# Altium schematic sheet CPU.SchDoc
size A3
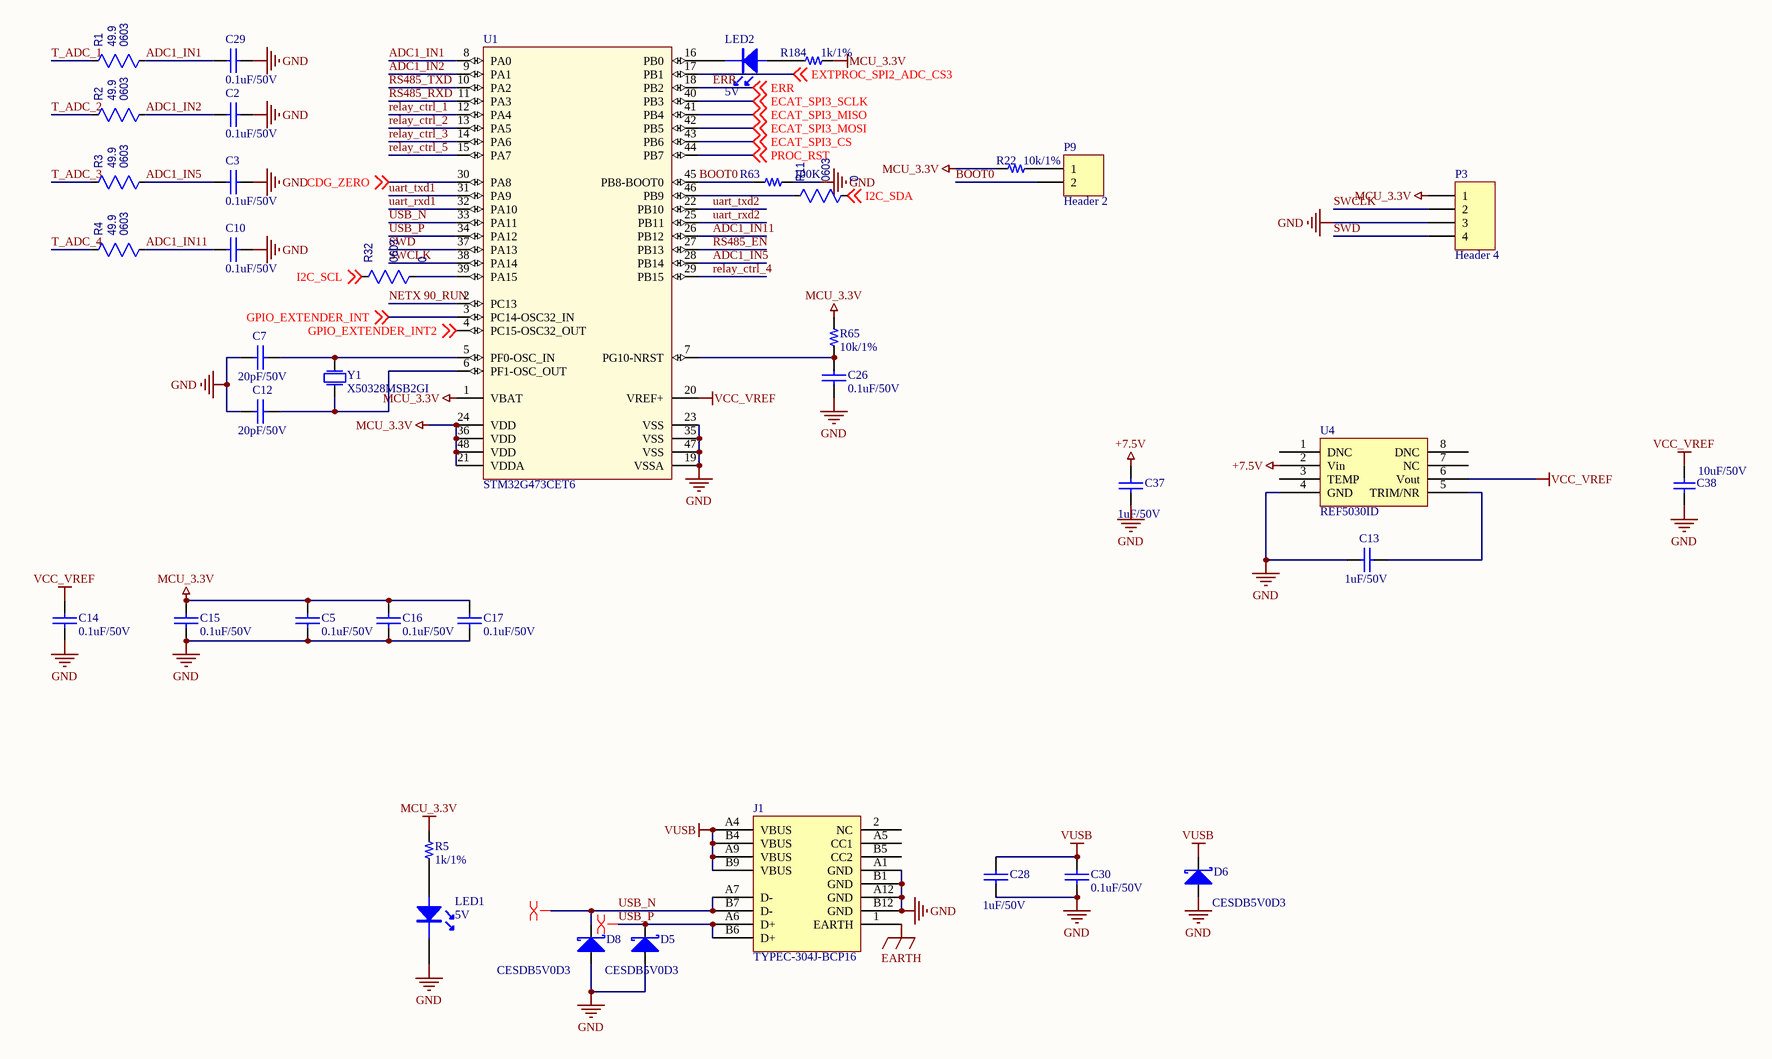
[diagram p0: CPU.SchDoc]

## Parts
C2  0.1uF/50V  [CAPC1608X092N_0603]
C3  0.1uF/50V  [CAPC1608X092N_0603]
C5  0.1uF/50V  [CAPC1608X092N_0603]
C7  value 20pF/50V  [CAPC1608X092N_0603]  (hidden comment: 20pF/25V)
C10  0.1uF/50V  [CAPC1608X092N_0603]
C12  value 20pF/50V  [CAPC1608X092N_0603]  (hidden comment: 20pF/25V)
C13  1uF/50V  [CAPC1608X092N_0603]
C14  0.1uF/50V  [CAPC1608X092N_0603]
C15  0.1uF/50V  [CAPC1608X092N_0603]
C16  0.1uF/50V  [CAPC1608X092N_0603]
C17  0.1uF/50V  [CAPC1608X092N_0603]
C26  0.1uF/50V  [CAPC1608X092N_0603]
C28  1uF/50V  [CAPC1608X092N_0603]
C29  0.1uF/50V  [CAPC1608X092N_0603]
C30  0.1uF/50V  [CAPC1608X092N_0603]
C37  1uF/50V  [CAPC1608X092N_0603]
C38  10uF/50V  [CAPC2012X127N_0805]
D5  CESDB5V0D3  [SOD323]
D6  CESDB5V0D3  [SOD323]
D8  CESDB5V0D3  [SOD323]
J1  TYPEC-304J-BCP16  [TYPEC_16P]
LED1  5V  [0603LED]
LED2  5V  [0603LED]
P3  Header 4  [HDR1X4]
P9  Header 2  [HDR1X2]
R1  Package: 0603  [RESC1608X055N_0603]  (hidden comment: 49.9)
R2  Package: 0603  [RESC1608X055N_0603]  (hidden comment: 49.9)
R3  Package: 0603  [RESC1608X055N_0603]  (hidden comment: 49.9)
R4  Package: 0603  [RESC1608X055N_0603]  (hidden comment: 49.9)
R5  1k/1%  [RESC1608X055N_0603]
R11  0  Package: 0603  [RESC1608X055N_0603]
R22  10k/1%  [RESC1608X055N_0603]
R32  0  Package: 0603  [RESC1608X055N_0603]
R63  100K  [RESC1608X055N_0603]
R65  10k/1%  [RESC1608X055N_0603]
R184  1k/1%  [RESC1608X055N_0603]
U1  STM32G473CET6  [STM-LQFP48_N]
U4  REF5030ID  [SO-8]
Y1  X50328MSB2GI  [CRAY_5032]

## Nets
+7.5V: C37.2 U4.2(Vin)
EARTH: J1.1(EARTH)
GND: C2.1 C3.1 C5.1 C7.2 C10.1 C12.2 C13.2 C14.1 C15.1 C16.1 C17.1 C26.1 C28.1 C29.1 C30.1 C37.1 C38.1 D5.1(A) D6.1(A) D8.1(A) J1.A1(GND) J1.A12(GND) J1.B1(GND) J1.B12(GND) LED1.2 P3.3 R63.2 U1.19(VSSA) U1.23(VSS) U1.35(VSS) U1.47(VSS) U4.4(GND)
MCU_3.3V: C5.2 C15.2 C16.2 C17.2 P3.1 R5.2 R22.1 R65.1 R184.2 U1.1(VBAT) U1.21(VDDA) U1.24(VDD) U1.36(VDD) U1.48(VDD)
VCC_VREF: C14.2 C38.2 U1.20(VREF+) U4.6(Vout)
VUSB: C28.2 C30.2 D6.2(K) J1.A4(VBUS) J1.A9(VBUS) J1.B4(VBUS) J1.B9(VBUS)
ADC1_IN1: C29.2 R1.1 U1.8(PA0)
ADC1_IN2: C2.2 R2.1 U1.9(PA1)
ADC1_IN5: C3.2 R3.1 U1.28(PB14)
ADC1_IN11: C10.2 R4.1 U1.26(PB12)
BOOT0: P9.2 R63.1 U1.45(PB8-BOOT0)
CDG_ZERO: U1.30(PA8) ; off-sheet CDG_ZERO
ECAT_SPI3_CS: U1.43(PB6) ; off-sheet ECAT_SPI3_CS
ECAT_SPI3_MISO: U1.41(PB4) ; off-sheet ECAT_SPI3_MISO
ECAT_SPI3_MOSI: U1.42(PB5) ; off-sheet ECAT_SPI3_MOSI
ECAT_SPI3_SCLK: U1.40(PB3) ; off-sheet ECAT_SPI3_SCLK
ERR: U1.18(PB2) ; off-sheet ERR
EXTPROC_SPI2_ADC_CS3: U1.17(PB1) ; off-sheet EXTPROC_SPI2_ADC_CS3
GPIO_EXTENDER_INT: U1.3(PC14-OSC32_IN) ; off-sheet GPIO_EXTENDER_INT
GPIO_EXTENDER_INT2: U1.4(PC15-OSC32_OUT) ; off-sheet GPIO_EXTENDER_INT2
I2C_SCL: R32.2 ; off-sheet I2C_SCL
I2C_SDA: R11.1 ; off-sheet I2C_SDA
NETX 90_RUN: U1.2(PC13)
PROC_RST: U1.44(PB7) ; off-sheet PROC_RST
relay_ctrl_1: U1.12(PA4)
relay_ctrl_2: U1.13(PA5)
relay_ctrl_3: U1.14(PA6)
relay_ctrl_4: U1.29(PB15)
relay_ctrl_5: U1.15(PA7)
RS485_EN: U1.27(PB13)
RS485_RXD: U1.11(PA3)
RS485_TXD: U1.10(PA2)
SWCLK: P3.2 U1.38(PA14)
SWD: P3.4 U1.37(PA13)
T_ADC_1: R1.2
T_ADC_2: R2.2
T_ADC_3: R3.2
T_ADC_4: R4.2
uart_rxd1: U1.32(PA10)
uart_rxd2: U1.25(PB11)
uart_txd1: U1.31(PA9)
uart_txd2: U1.22(PB10)
USB_N: D8.2(K) J1.A7(D-) J1.B7(D-) U1.33(PA11)
USB_P: D5.2(K) J1.A6(D+) J1.B6(D+) U1.34(PA12)
NetC7_1: C7.1 U1.5(PF0-OSC_IN) Y1.1(P1)
NetC12_1: C12.1 U1.6(PF1-OSC_OUT) Y1.2(P2)
NetC13_1: C13.1 U4.5(TRIM/NR)
NetC26_2: C26.2 R65.2 U1.7(PG10-NRST)
NetLED1_1: LED1.1 R5.1
NetLED2_1: LED2.1 R184.1
NetLED2_2: LED2.2 U1.16(PB0)
NetP9_1: P9.1 R22.2
NetR11_2: R11.2 U1.46(PB9)
NetR32_1: R32.1 U1.39(PA15)

Not connected (* = marked no-connect by the designer): J1 2(NC) A5(CC1) B5(CC2); U4 1(DNC) 3(TEMP) 7(NC) 8(DNC)

## Layout directives
differential pair: USB_N, USB_P

## Library data of the parts
C2 C3 C5 C10 C14-C17 C26 C29 C30 = CAP: PartNumber: CC0603KRX7R9BB104; Value: 0.1uF/50V; Package: 0603
C7 C12 = CAP: PartNumber: CC0603JRNPO9BN200; Package: 0603
C13 C28 C37 = CAP: PartNumber: CL10A105KB8NNNC; Value: 1uF/50V; Package: 0603
C38 = Cap: PartNumber: CL21A106KBYQNNE; Published: 8-Jun-2000; PackageReference: RAD-0.3; Publisher: Altium Limited; PackageDescription: Radial Cap, Thru-Hole; 2 Leads; 0.3 in Pin Spacing; Value: 10uF/50V; Package: 0805
D5 D6 D8 = DIODE S: PartNumber: CESDB5V0D3
  D5: Value: CESDB5V0D3
J1 = TYPE C_16P: Value: TYPEC-304J-BCP16; PartNumber: TYPEC-304J-BCP16
LED1 LED2 = LED: Package: 0603
P3 = Header 4: PartNumber: PZ254V-11-04P; Publisher: Altium Limited
P9 = Header 2: PartNumber: PZ254V-11-02P; Publisher: Altium Limited
R1-R4 = Resistor_0603: PartNumber: RC0603FR-0749R9L; Power Rating: [power]; TempCo: [tempco]; Tolerance: tol; Value: 49.9; SupplierDescription: RES SMD 1K OHM 1% 1/10W 0603
R5 R184 = R: PartNumber: RC0603FR-071KL; Value: 1k/1%; Package: 0603
R11 R32 = Resistor_0603: PartNumber: RC0603JR-070RL; Power Rating: [power]; TempCo: [tempco]; Tolerance: tol; Value: 0; SupplierDescription: RES SMD 1K OHM 1% 1/10W 0603
R22 R65 = R: PartNumber: RC0603FR-0710KL; Value: 10k/1%; Package: 0603
R63 = R: PartNumber: RC0603FR-07100KL; Value: 100K; Package: 0603
U1 = STM32G473CET6: Operating Frequency(F) (Processor speed) (MHz): 170; Packing: Tray; Supply Voltage(Vcc) min (V): 1.71; Supply Voltage(Vcc) max (V): 3.6; Package Description: 48-Pin Low Profile Quad Flat Package, Body 7 x 7 mm, Pitch 0.5 mm; Mounting Technology: Surface Mount; Package Reference: LQFP48; PartNumber: STM32G473CET6; Value: STM32G473CET6
U4 = REF5030: PartNumber: REF5030IDR; Value: REF5030ID
Y1 = XTAL: Value: X50328MSB2GI; PartNumber: X50328MSB2GI